# EAGLE design water (EAGLE 9.6.2)
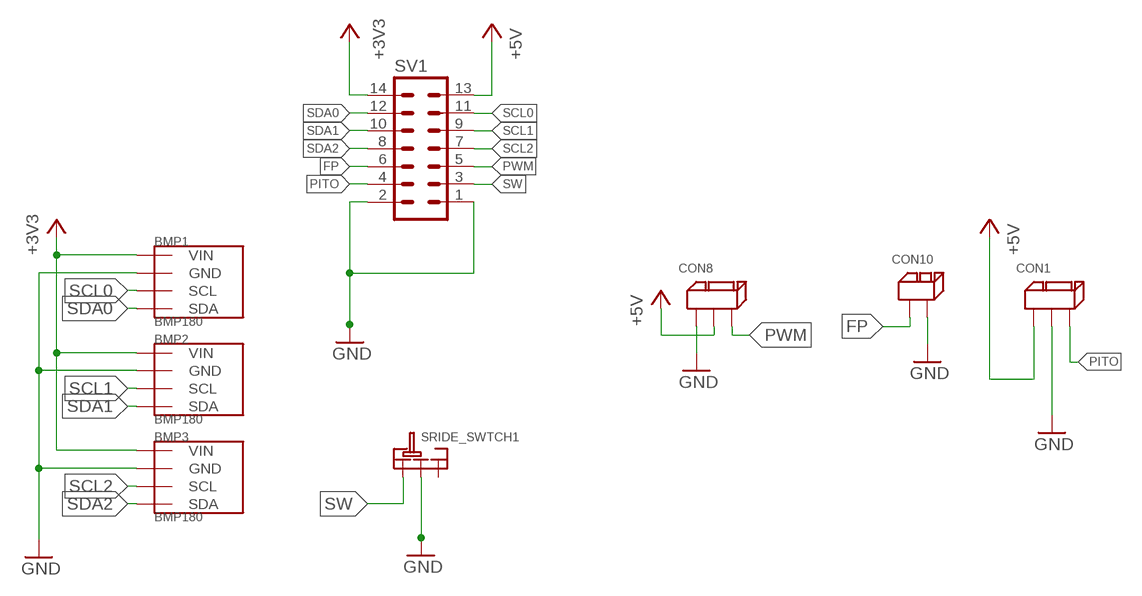
[diagram p0: schematic, sheet 1]

## Parts
BMP1  BMP180  [GY-68]
BMP2  BMP180  [GY-68]
BMP3  BMP180  [GY-68]
CON1  3PIN  [3PIN]
CON8  3PIN  [3PIN]
CON10  2PIN  [2PIN]
SRIDE_SWTCH1  SRIDE_SWITCH  [SRIDE_SWITCH]
SV1  ML14L  [ML14L]

## Nets
+3V3: BMP1.P1(VIN) BMP2.P1(VIN) BMP3.P1(VIN) SV1.14
+5V: CON1.P$1 CON8.P$2 SV1.13
FP: CON10.P$1 SV1.6
GND: BMP1.P2(GND) BMP2.P2(GND) BMP3.P2(GND) CON1.P$2 CON8.P$1 CON10.P$2 SRIDE_SWTCH1.LR SV1.1 SV1.2
PITO: CON1.P$3 SV1.4
PWM: CON8.P$3 SV1.5
SCL0: BMP1.P3(SCL) SV1.11
SCL1: BMP2.P3(SCL) SV1.9
SCL2: BMP3.P3(SCL) SV1.7
SDA0: BMP1.P4(SDA) SV1.12
SDA1: BMP2.P4(SDA) SV1.10
SDA2: BMP3.P4(SDA) SV1.8
SW: SRIDE_SWTCH1.L SV1.3
Unconnected: SRIDE_SWTCH1.R

## Library data of the parts
BMP1-BMP3 = BMP180:BMP180
CON1 CON8 = XR Connector:3PIN
CON10 = XR Connector:2PIN
SRIDE_SWTCH1 = Sride Switch:SRIDE_SWITCH
SV1 = con-ml:ML14L: HARTING; OC_FARNELL: unknown; OC_NEWARK: unknown

## Net classes
0 default: width 0.635 mm

## Board
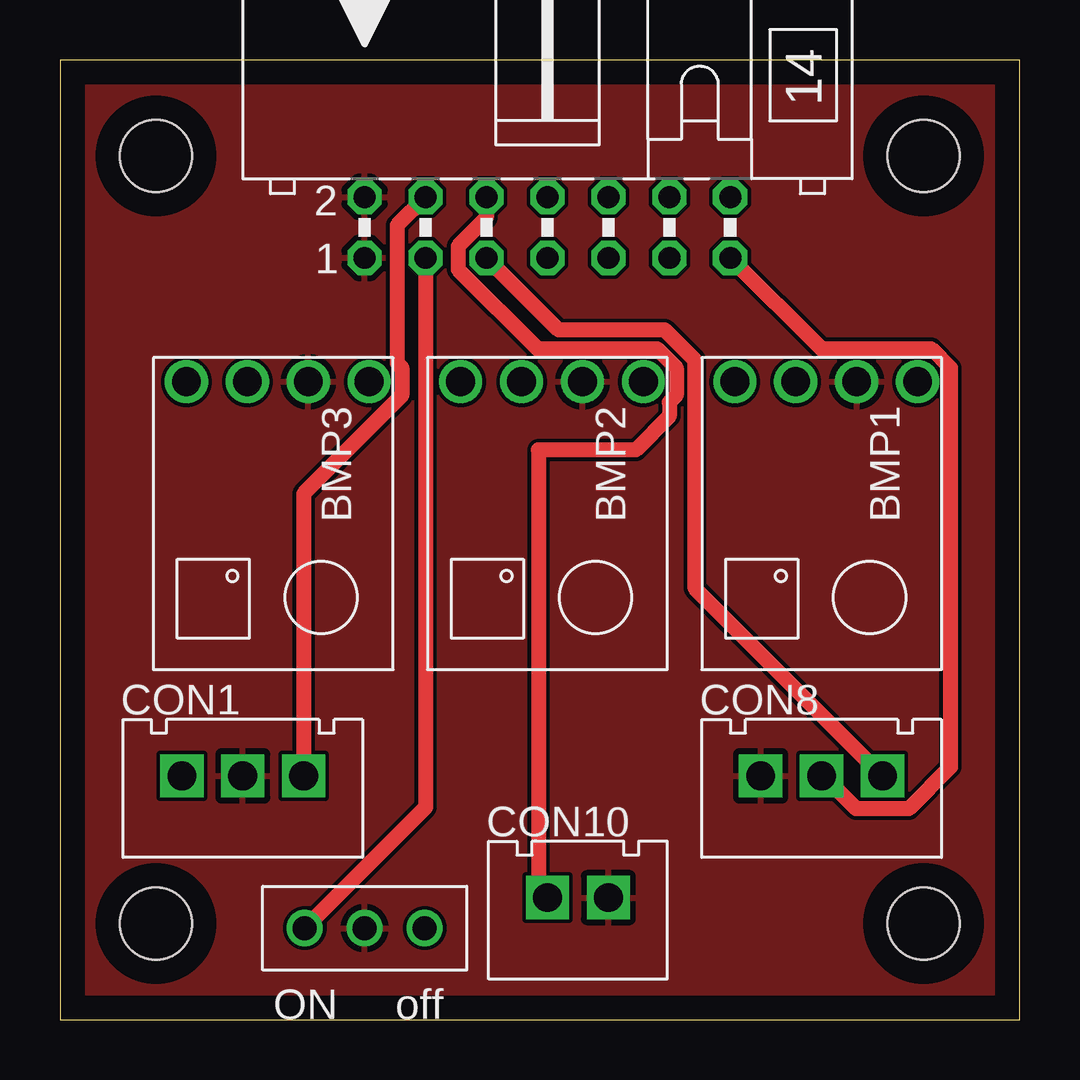
[diagram p1: board, top side]
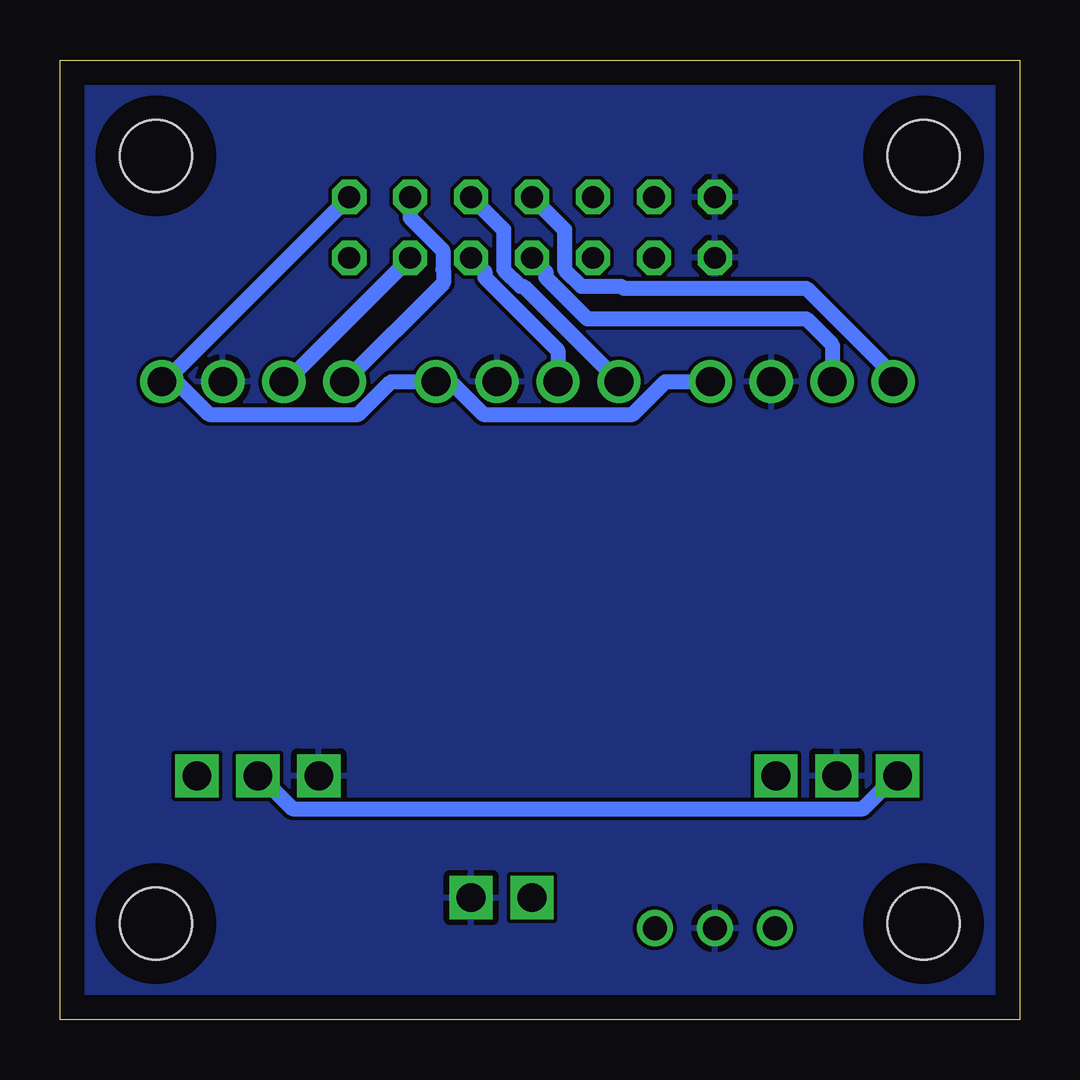
[diagram p2: board, bottom side, seen from below]

Size 40 x 40 mm. Coordinates in mm from the lower left corner, seen from the top.
Outline: 0,0 40,0 40,40 0,40 0,0
Copper layers (1*16): Top 0.035mm / dielectric 1.5mm / Bottom 0.035mm
Design rules "default": minimum track width 6mil, minimum drill 0.35mm, track to track 6mil, track to pad 6mil, pad to pad 6mil, via to via 6mil, smd to smd 6mil, copper to edge 40mil, drill to drill 6mil, minimum pad ring 10mil, minimum via ring 8mil, stop-mask expansion 4mil, vias tented up to drill 0mil, thermal gap 10mil
Holes 3 mm at 4,36 36,36 4,4 36,4

### Footprints (pad centres in the part's own frame; a part is rotated, then mirrored left to right if it is on the bottom)
GY-68 = drill 1.2: P1 -5,4; P2 -5,1.46; P3 -5,-1.08; P4 -5,-3.62
3PIN = drill 1.2 square: P$1 2.54,-2.54; P$2 5.08,-2.54; P$3 7.62,-2.54
2PIN = drill 1.2 square: P$1 -1.27,0; P$2 1.27,0
SRIDE_SWITCH = drill 1: L -2.5,0; LR 0,0; R 2.5,0
ML14L = drill 0.914 octagon: 1 -7.62,-1.27; 2 -7.62,1.27; 3 -5.08,-1.27; 4 -5.08,1.27; 5 -2.54,-1.27; 6 -2.54,1.27; 7 0,-1.27; 8 0,1.27; 9 2.54,-1.27; 10 2.54,1.27; 11 5.08,-1.27; 12 5.08,1.27; 13 7.62,-1.27; 14 7.62,1.27

### Placement (x,y rotation side)
BMP1  31.75,21.59 270 top
BMP2  20.32,21.59 270 top
BMP3  8.89,21.59 270 top
CON1  2.54,12.7 0 top
CON8  26.67,12.7 0 top
CON10  21.59,5.08 0 top
SRIDE_SWTCH1  12.7,3.81 0 top
SV1  20.32,33.02 0 top

### Tracks (layer width: path | path; a pad name or v marks a point on that pad's centre or on a via)
+3V3
  Bottom 0.635: SV1.14 35.64,26.59 BMP1.P1 35.15,26.59 33.78,25.22 27.56,25.22 26.19,26.59 BMP2.P1 23.72,26.59 22.35,25.22 16.13,25.22 14.76,26.59 BMP3.P1
+5V
  Top 0.635: SV1.13 31.73,27.96 36.32,27.96 37.12,27.16 37.12,10.53 35.38,8.79 33.2,8.79 31.82,10.16 CON8.P$2
  Bottom 0.635: CON8.P$2 31.68,10.16 30.3,8.79 6.53,8.79 5.16,10.16 CON1.P$1
FP
  Top 0.635: SV1.6 17.78,33.42 16.6,32.24 16.6,31.26 19.9,27.96 24.89,27.96 25.69,27.16 25.69,26.02 25.4,25.73 25.4,25.15 24,23.75 19.94,23.75 19.94,5.46 CON10.P$1
GND
  pour Top: -1.27,46.99 44.45,46.99 45.72,45.72 45.72,-2.54 43.18,-5.08 41.91,-6.35 -10.16,-6.35 -10.16,45.72 -8.89,46.99
  pour Bottom: -2.54,38.1 -2.54,46.99 39.37,46.99 44.45,41.91 44.45,-1.27 41.91,-3.81 -1.27,-3.81 -3.81,-1.27 -3.81,36.83
PITO
  Top 0.635: CON1.P$3 10.16,21.92 14.26,26.02 14.26,27.16 14.06,27.36 14.06,33.11 SV1.4
PWM
  Top 0.635: CON8.P$3 26.48,17.97 26.48,27.48 25.21,28.75 20.78,28.75 SV1.5
SCL0
  Bottom 0.635: SV1.11 30.56,26.59 BMP1.P3
SCL1
  Bottom 0.635: SV1.9 22.29,31.18 22.29,30.93 19.24,27.89 BMP2.P3
SCL2
  Bottom 0.635: SV1.7 19.75,31.18 19.75,30.93 18.02,29.21 8.89,29.21 7.81,28.13 BMP3.P3
SDA0
  Bottom 0.635: SV1.12 25.4,33.42 24.04,32.06 24.04,31.26 24.01,31.23 24.01,30.71 BMP1.P4
SDA1
  Bottom 0.635: SV1.10 21.5,32.93 21.5,31.26 20.81,30.57 20.68,30.57 BMP2.P4
SDA2
  Bottom 0.635: SV1.8 18.96,32.93 18.96,31.26 18.27,30.57 16.6,30.57 16.51,30.48 8.89,30.48 5.27,26.86 BMP3.P4
SW
  Top 0.635: SV1.3 15.24,8.85 SRIDE_SWTCH1.L

### Text on the board
tPlace: ON | off